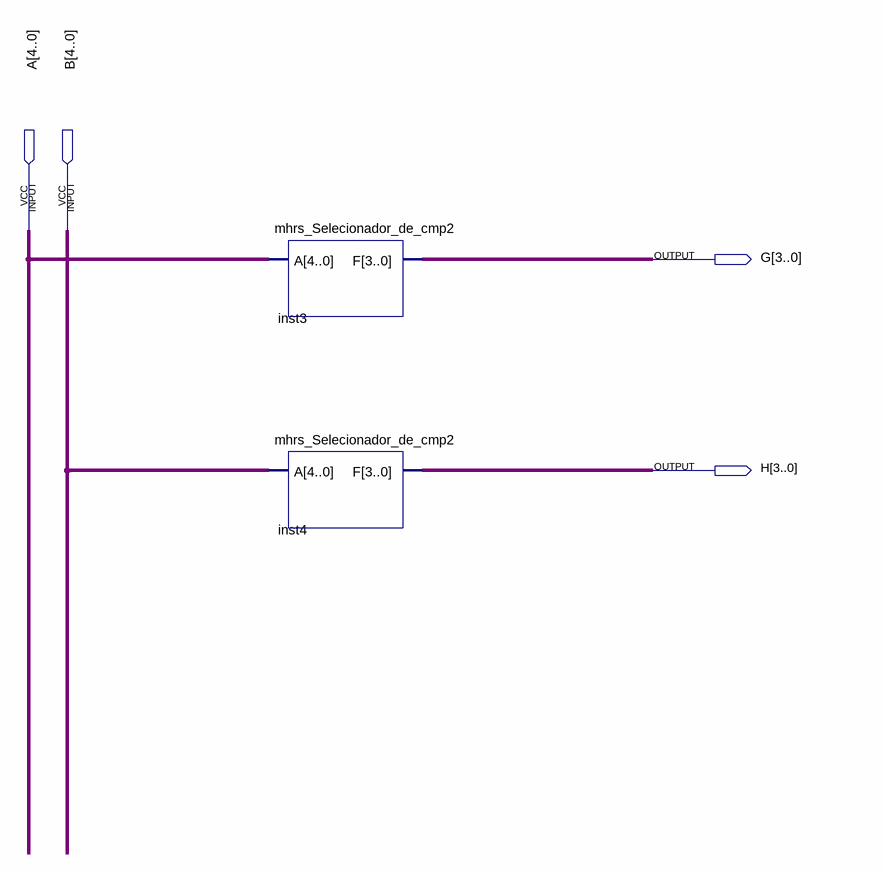
[diagram p0: schematic sheet]
// Quartus schematic eos_somador.bdf as structural Verilog: 2 symbols, 4 pins
module eos_somador (
  input  [4:0] A,
  input  [4:0] B,
  output [3:0] G,
  output [3:0] H
);

  mhrs_Selecionador_de_cmp2 inst3 (.A(A), .F(G));
  mhrs_Selecionador_de_cmp2 inst4 (.A(B), .F(H));
endmodule
